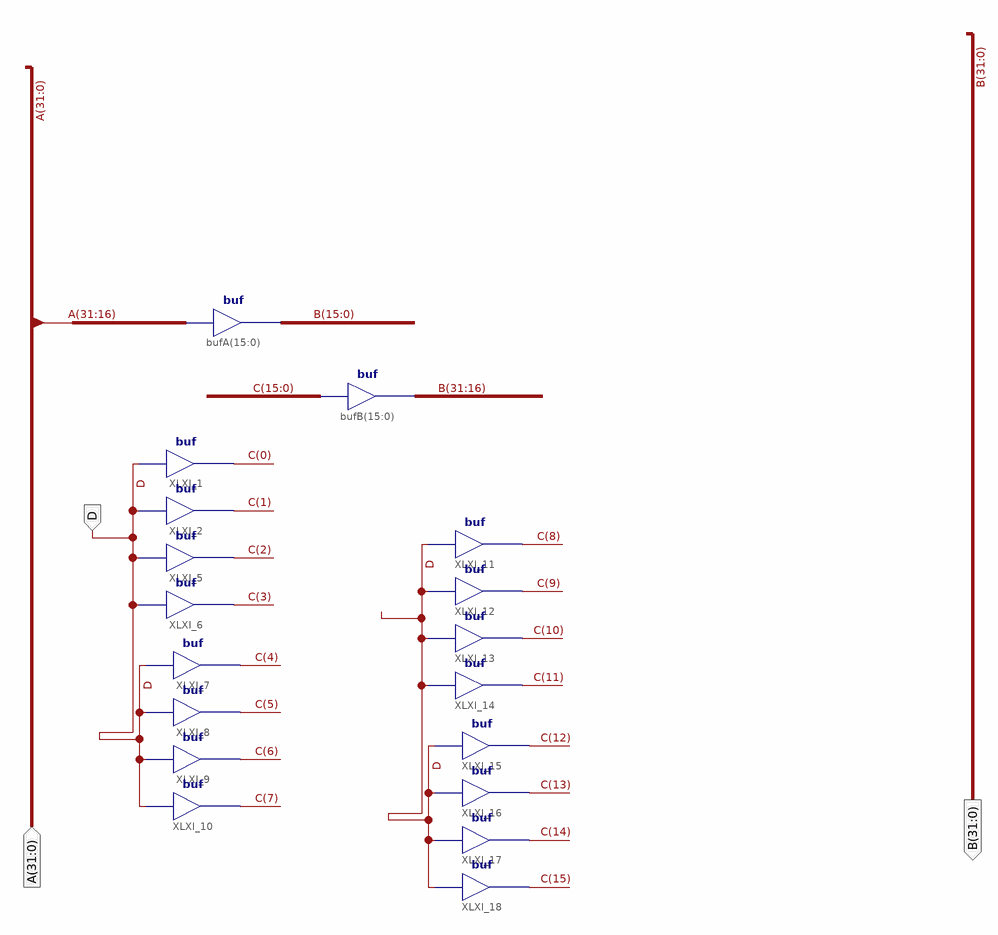
[diagram p0: schematic sheet 1]
// Xilinx ISE schematic shift_16bits.sch (artix7) as structural Verilog: 18 symbols, 3 ports
module shift_16bits (
  input  [31:0] A,
  input  D,
  output [31:0] B
);

  wire [15:0] C;

  assign B[31:16] = C;  // buf bufB[15..0], 16 bits wide
  assign B[15:0] = A[31:16];  // buf bufA[15..0], 16 bits wide
  buf XLXI_1 (C[0], D);
  buf XLXI_2 (C[1], D);
  buf XLXI_5 (C[2], D);
  buf XLXI_6 (C[3], D);
  buf XLXI_7 (C[4], D);
  buf XLXI_8 (C[5], D);
  buf XLXI_9 (C[6], D);
  buf XLXI_10 (C[7], D);
  buf XLXI_11 (C[8], D);
  buf XLXI_12 (C[9], D);
  buf XLXI_13 (C[10], D);
  buf XLXI_14 (C[11], D);
  buf XLXI_15 (C[12], D);
  buf XLXI_16 (C[13], D);
  buf XLXI_17 (C[14], D);
  buf XLXI_18 (C[15], D);
endmodule
